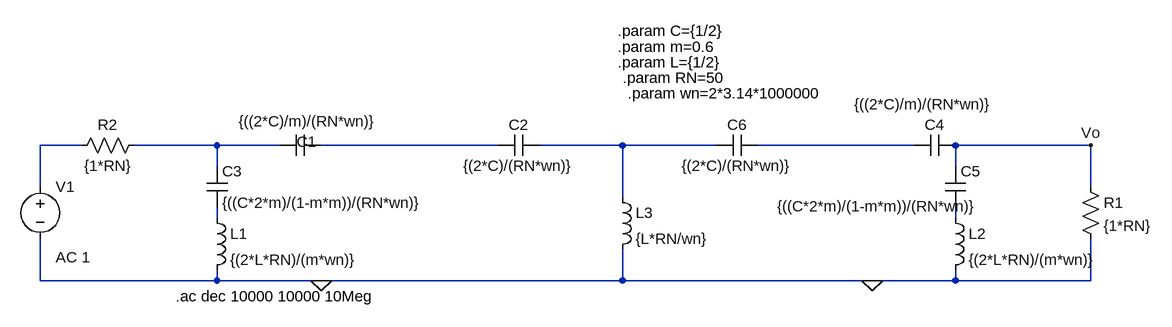
[diagram p0: schematic kcte.asc]
kcte.asc, the LTspice schematic file:
Version 4
SHEET 1 1564 680
WIRE -176 112 -240 112
WIRE 32 112 -96 112
WIRE 128 112 32 112
WIRE 464 112 192 112
WIRE 656 112 528 112
WIRE 800 112 656 112
WIRE 1104 112 864 112
WIRE 1376 112 1168 112
WIRE 32 144 32 112
WIRE 1168 144 1168 112
WIRE -240 176 -240 112
WIRE 1376 176 1376 112
WIRE 656 192 656 112
WIRE 32 224 32 208
WIRE 1168 224 1168 208
WIRE -240 320 -240 256
WIRE 32 320 32 304
WIRE 32 320 -240 320
WIRE 192 320 32 320
WIRE 656 320 656 272
WIRE 656 320 192 320
WIRE 1040 320 656 320
WIRE 1168 320 1168 304
WIRE 1168 320 1040 320
WIRE 1376 320 1376 256
WIRE 1376 320 1168 320
FLAG 192 320 0
FLAG 1040 320 0
FLAG 1376 112 Vo
SYMBOL cap 192 96 R90
WINDOW 0 26 22 VBottom 2
WINDOW 3 -37 20 VTop 2
SYMATTR InstName C1
SYMATTR Value {((2*C)/m)/(RN*wn)}
SYMBOL cap 16 144 R0
SYMATTR InstName C3
SYMATTR Value {((C*2*m)/(1-m*m))/(RN*wn)}
SYMBOL ind 16 208 R0
SYMATTR InstName L1
SYMATTR Value {(2*L*RN)/(m*wn)}
SYMBOL cap 1168 96 R90
WINDOW 0 0 32 VBottom 2
WINDOW 3 -63 49 VTop 2
SYMATTR InstName C4
SYMATTR Value {((2*C)/m)/(RN*wn)}
SYMBOL ind 1152 208 R0
SYMATTR InstName L2
SYMATTR Value {(2*L*RN)/(m*wn)}
SYMBOL cap 1152 144 R0
WINDOW 3 -258 62 Left 2
SYMATTR InstName C5
SYMATTR Value {((C*2*m)/(1-m*m))/(RN*wn)}
SYMBOL cap 528 96 R90
WINDOW 0 0 32 VBottom 2
WINDOW 3 32 32 VTop 2
SYMATTR InstName C2
SYMATTR Value {(2*C)/(RN*wn)}
SYMBOL cap 864 96 R90
WINDOW 0 0 32 VBottom 2
WINDOW 3 32 32 VTop 2
SYMATTR InstName C6
SYMATTR Value {(2*C)/(RN*wn)}
SYMBOL ind 640 176 R0
SYMATTR InstName L3
SYMATTR Value {L*RN/wn}
SYMBOL res 1360 160 R0
SYMATTR InstName R1
SYMATTR Value {1*RN}
SYMBOL res -80 96 R90
WINDOW 0 0 56 VBottom 2
WINDOW 3 32 56 VTop 2
SYMATTR InstName R2
SYMATTR Value {1*RN}
SYMBOL voltage -240 160 R0
WINDOW 123 24 124 Left 2
WINDOW 39 0 0 Left 0
SYMATTR InstName V1
SYMATTR Value ""
SYMATTR Value2 AC 1
TEXT 648 -64 Left 2 !.param C={1/2}
TEXT -32 344 Left 2 !.ac dec 10000 10000 10Meg
TEXT 648 -40 Left 2 !.param m=0.6
TEXT 648 -16 Left 2 !.param L={1/2}
TEXT 656 8 Left 2 !.param RN=50
TEXT 664 32 Left 2 !.param wn=2*3.14*1000000

The netlist it stands for:
* kcte.asc
C1 N003 N002 {((2*C)/m)/(RN*wn)}
C3 N002 N006 {((C*2*m)/(1-m*m))/(RN*wn)}
L1 N006 0 {(2*L*RN)/(m*wn)}
C4 Vo N005 {((2*C)/m)/(RN*wn)}
L2 N007 0 {(2*L*RN)/(m*wn)}
C5 Vo N007 {((C*2*m)/(1-m*m))/(RN*wn)}
C2 N004 N003 {(2*C)/(RN*wn)}
C6 N005 N004 {(2*C)/(RN*wn)}
L3 N004 0 {L*RN/wn}
R1 Vo 0 {1*RN}
R2 N002 N001 {1*RN}
V1 N001 0 AC 1
.param C={1/2}
.ac dec 10000 10000 10Meg
.param m=0.6
.param L={1/2}
.param RN=50
.param wn=2*3.14*1000000
.backanno
.end